# EAGLE design Laser_Terminal_new (EAGLE 9.2.2)
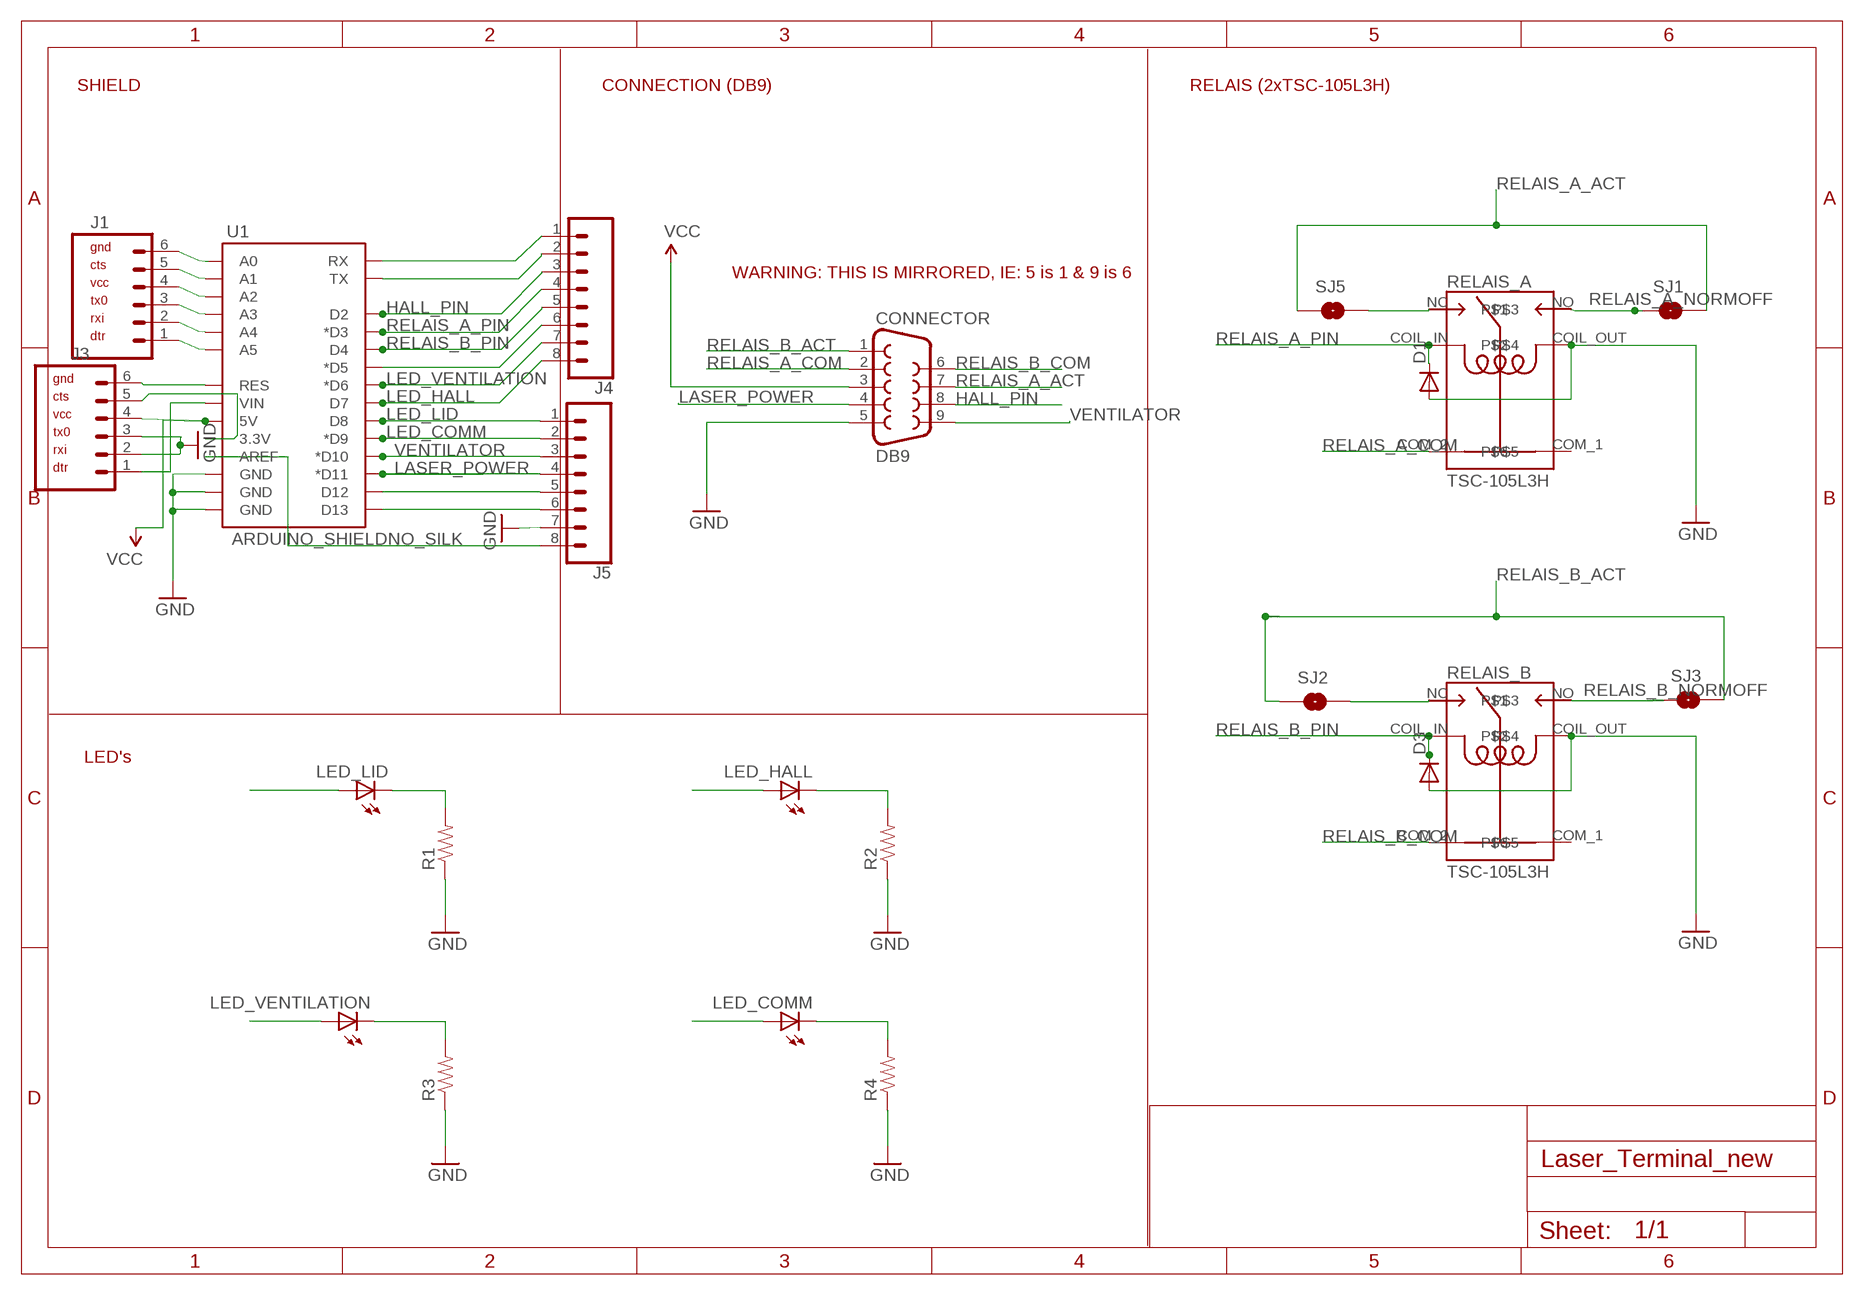
[diagram p0: schematic, sheet 1]

## Parts
CONNECTOR  DB9  DB9MALE  [DB9_MALE]
D1  DIODEPTH  [DIODE-1N4001]
D3  DIODEPTH  [DIODE-1N4001]
J1  M06NO_SILK_YES_STOP  [1X06_NO_SILK_YES_STOP]
J3  M06NO_SILK_YES_STOP  [1X06_NO_SILK_YES_STOP]
J4  CONN_08"  [1X08]
J5  CONN_08"  [1X08]
LED_COMM  LED5MM  [LED5MM]
LED_HALL  LED5MM  [LED5MM]
LED_LID  LED5MM  [LED5MM]
LED_VENTILATION  LED5MM  [LED5MM]
R1  RESISTORAXIAL-0.3  [AXIAL-0.3]
R2  RESISTORAXIAL-0.3  [AXIAL-0.3]
R3  RESISTORAXIAL-0.3  [AXIAL-0.3]
R4  RESISTORAXIAL-0.3  [AXIAL-0.3]
RELAIS_A  TSC-105L3H  TSC-112L3H  [TSC_112L3H]
RELAIS_B  TSC-105L3H  TSC-112L3H  [TSC_112L3H]
SJ1  SOLDERJUMPERNO  [SJ_2S-NO]
SJ2  SOLDERJUMPERNO  [SJ_2S-NO]
SJ3  JUMPER-SMT_2_NO_SILK  [SMT-JUMPER_2_NO_SILK]
SJ5  SOLDERJUMPERNO  [SJ_2S-NO]
U1  ARDUINO_SHIELDNO_SILK  [DUEMILANOVE_VIAS]

## Nets
GND: CONNECTOR.5 D1.A D3.A J3.2 J3.3 J5.7 R1.P$1 R2.P$1 R3.P$1 R4.P$1 RELAIS_A.COIL_OUT RELAIS_B.COIL_OUT U1.GND@0(GND) U1.GND@1(GND) U1.GND@2(GND)
HALL_PIN: CONNECTOR.8 J4.3 U1.D2
LASER_POWER: CONNECTOR.4 J5.4 U1.D11(*D11)
LED_COMM: J5.2 LED_COMM.A U1.D9(*D9)
LED_HALL: J4.8 LED_HALL.A U1.D7
LED_LID: J5.1 LED_LID.A U1.D8
LED_VENTILATION: J4.7 LED_VENTILATION.A U1.D6(*D6)
N$1: RELAIS_B.NC SJ2.2
N$3: J1.6 U1.A0
N$4: J1.5 U1.A1
N$5: J1.4 U1.A2
N$6: J1.3 U1.A3
N$7: LED_LID.K(C) R1.P$2
N$8: LED_HALL.K(C) R2.P$2
N$9: LED_VENTILATION.K(C) R3.P$2
N$10: LED_COMM.K(C) R4.P$2
N$11: J1.2 U1.A4
N$12: J1.1 U1.A5
N$13: J5.5 U1.D12
N$14: J5.6 U1.D13
N$15: RELAIS_A.NC SJ5.2
N$16: J3.1 U1.VIN
N$19: J3.5 U1.3.3V
N$20: J3.6 U1.RES
N$21: J4.1 U1.RX
N$22: J4.2 U1.TX
N$28: J4.6 U1.D5(*D5)
N$29: J5.8 U1.AREF
RELAIS_A_ACT: CONNECTOR.7 SJ1.2 SJ5.1
RELAIS_A_COM: CONNECTOR.2 RELAIS_A.COM_2
RELAIS_A_NORMOFF: RELAIS_A.NO SJ1.1
RELAIS_A_PIN: D1.C J4.4 RELAIS_A.COIL_IN U1.D3(*D3)
RELAIS_B_ACT: CONNECTOR.1 SJ2.1 SJ3.2
RELAIS_B_COM: CONNECTOR.6 RELAIS_B.COM_2
RELAIS_B_NORMOFF: RELAIS_B.NO SJ3.1
RELAIS_B_PIN: D3.C J4.5 RELAIS_B.COIL_IN U1.D4
VCC: CONNECTOR.3 J3.4 U1.5V
VENTILATOR: CONNECTOR.9 J5.3 U1.D10(*D10)
Unconnected: RELAIS_A.COM_1 RELAIS_B.COM_1

## Notes on the sheet
- SHIELD | CONNECTION (DB9) | RELAIS (2xTSC-105L3H)
- WARNING: THIS IS MIRRORED, IE: 5 is 1 & 9 is 6
- LED's

## Library data of the parts
CONNECTOR = SparkFun:DB9: DB9 Connector Standard DB9 (D-Sub 9) serial connector. Can be used for CAN bus as well as RS485 and RS232. Footprint production proven. Spark Fun Electronics SKU : PRT-00429
D1 D3 = SparkFun:DIODE: Diode These are standard reverse protection diodes and small signal diodes. SMA package can handle up to about 1A. SOD-323 can handle about 200mA. What the SOD-323 package when ordering, there are some mfgs out there that are 5-pin packages.
J1 J3 = SparkFun-Connectors:M06: Header 6 Standard 6-pin 0.1" header. Use with straight break away headers (SKU : PRT-00116), right angle break away headers (PRT-00553), swiss pins (PRT-00743), machine pins (PRT-00117), and female headers (PRT-00115). Molex polarized connector foot print use with SKU : PRT-08094 with associated crimp pins and housings. NOTES ON THE VARIANTS LOCK and LOCK_LONGPADS... This footprint was designed to help hold the alignment of a through-hole component (i.e. 6-pin header) while soldering it into place. You may notice that each hole has been shifted either up or down by 0.005 of an inch from it's more standard position (which is a perfectly straight line). This slight alteration caused the pins (the squares in the middle) to touch the edges of the holes. Because they are alternating, it causes a "brace" to hold the component in place. 0.005 has proven to be the perfect amount of "off-center" position when using our standard breakaway headers. Although looks a little odd when you look at the bare footprint, once you have a header in there, the alteration is very hard to notice. Also,if you push a header all the way into place, it is covered up entirely on the bottom side. This idea of altering the position of holes to aid alignment will be further integrated into the Sparkfun Library for other footprints. It can help hold any component with 3 or more connection pins.
J4 J5 = SparkFun-Connectors:CONN_08: Multi connection point. Often used as Generic Header-pin footprint for 0.1 inch spaced/style header connections On any of the 0.1 inch spaced packages, you can populate with these: Break Away Headers - Straight <https://www.sparkfun.com/products/116> (PRT-00116) Break Away Male Headers - Right Angle <https://www.sparkfun.com/products/553> (PRT-00553) Female Headers <https://www.sparkfun.com/products/115> (PRT-00115) Break Away Headers - Machine Pin <https://www.sparkfun.com/products/117> (PRT-00117) Break Away Female Headers - Swiss Machine Pin <https://www.sparkfun.com/products/743> (PRT-00743) Arduino Stackable Header - 8 Pin <https://www.sparkfun.com/products/9279> (PRT-09279) For SCREWTERMINALS and SPRING TERMINALS visit here: Screw Terimnals on SparkFun.com <https://www.sparkfun.com/search/results?term=Screw+Terminals> (5mm/3.5mm/2.54mm spacing) This device is also useful as a general connection point to wire up your design to another part of your project. Our various solder wires solder well into these plated through hole pads. Hook-Up Wire - Assortment (Stranded, 22 AWG) <https://www.sparkfun.com/products/11375> (PRT-11375) Hook-Up Wire - Assortment (Solid Core, 22 AWG) <https://www.sparkfun.com/products/11367> (PRT-11367) View the entire wire category on our website here <https://www.sparkfun.com/categories/141> Special notes: Molex polarized connector foot print use with SKU : PRT-08231 with associated crimp pins and housings. 1MM SMD Version SKU: PRT-10208 NOTES ON THE VARIANTS LOCK and LOCK_LONGPADS... This footprint was designed to help hold the alignment of a through-hole component (i.e. 6-pin header) while soldering it into place. You may notice that each hole has been shifted either up or down by 0.005 of an inch from it's more standard position (which is a perfectly straight line). This slight alteration caused the pins (the squares in the middle) to touch the edges of the holes. Because they are alternating, it causes a "brace" to hold the component in place. 0.005 has proven to be the perfect amount of "off-center" position when using our standard breakaway headers. Although looks a little odd when you look at the bare footprint, once you have a header in there, the alteration is very hard to notice. Also,if you push a header all the way into place, it is covered up entirely on the bottom side.; PROD_ID: CONN-08438
LED_COMM LED_HALL LED_LID LED_VENTILATION = SparkFun:LED: LEDs Standard schematic elements and footprints for 5mm, 3mm, 1206, and 0603 sized LEDs. 5mm - Spark Fun Electronics SKU : COM-00529 (and others)
R1-R4 = SparkFun:RESISTOR: Resistor Basic schematic elements and footprints for 0603, 1206, and PTH resistors.
RELAIS_A RELAIS_B = Custom:TSC-112L3H
SJ1 SJ2 SJ5 = RP400N501A:SOLDERJUMPER: Solder Jumper Standard SMD solder jumper. Used to automate production. Two varients : Normally Open and Normally Closed are the same, but have different paste layers. NC will have a large amount of paste and should jumper during reflow.
SJ3 = SparkFun-Jumpers:JUMPER-SMT_2_NO: Normally open jumper This jumper has two pads in close proximity to each other. Apply solder to close the connection. Round pads are easier to solder for beginners, but are a lot larger. SparkFun Product that uses the round pads: SparkFun EL Sequencer <https://www.sparkfun.com/products/12781>
U1 = SparkFun:ARDUINO_SHIELD

## Board
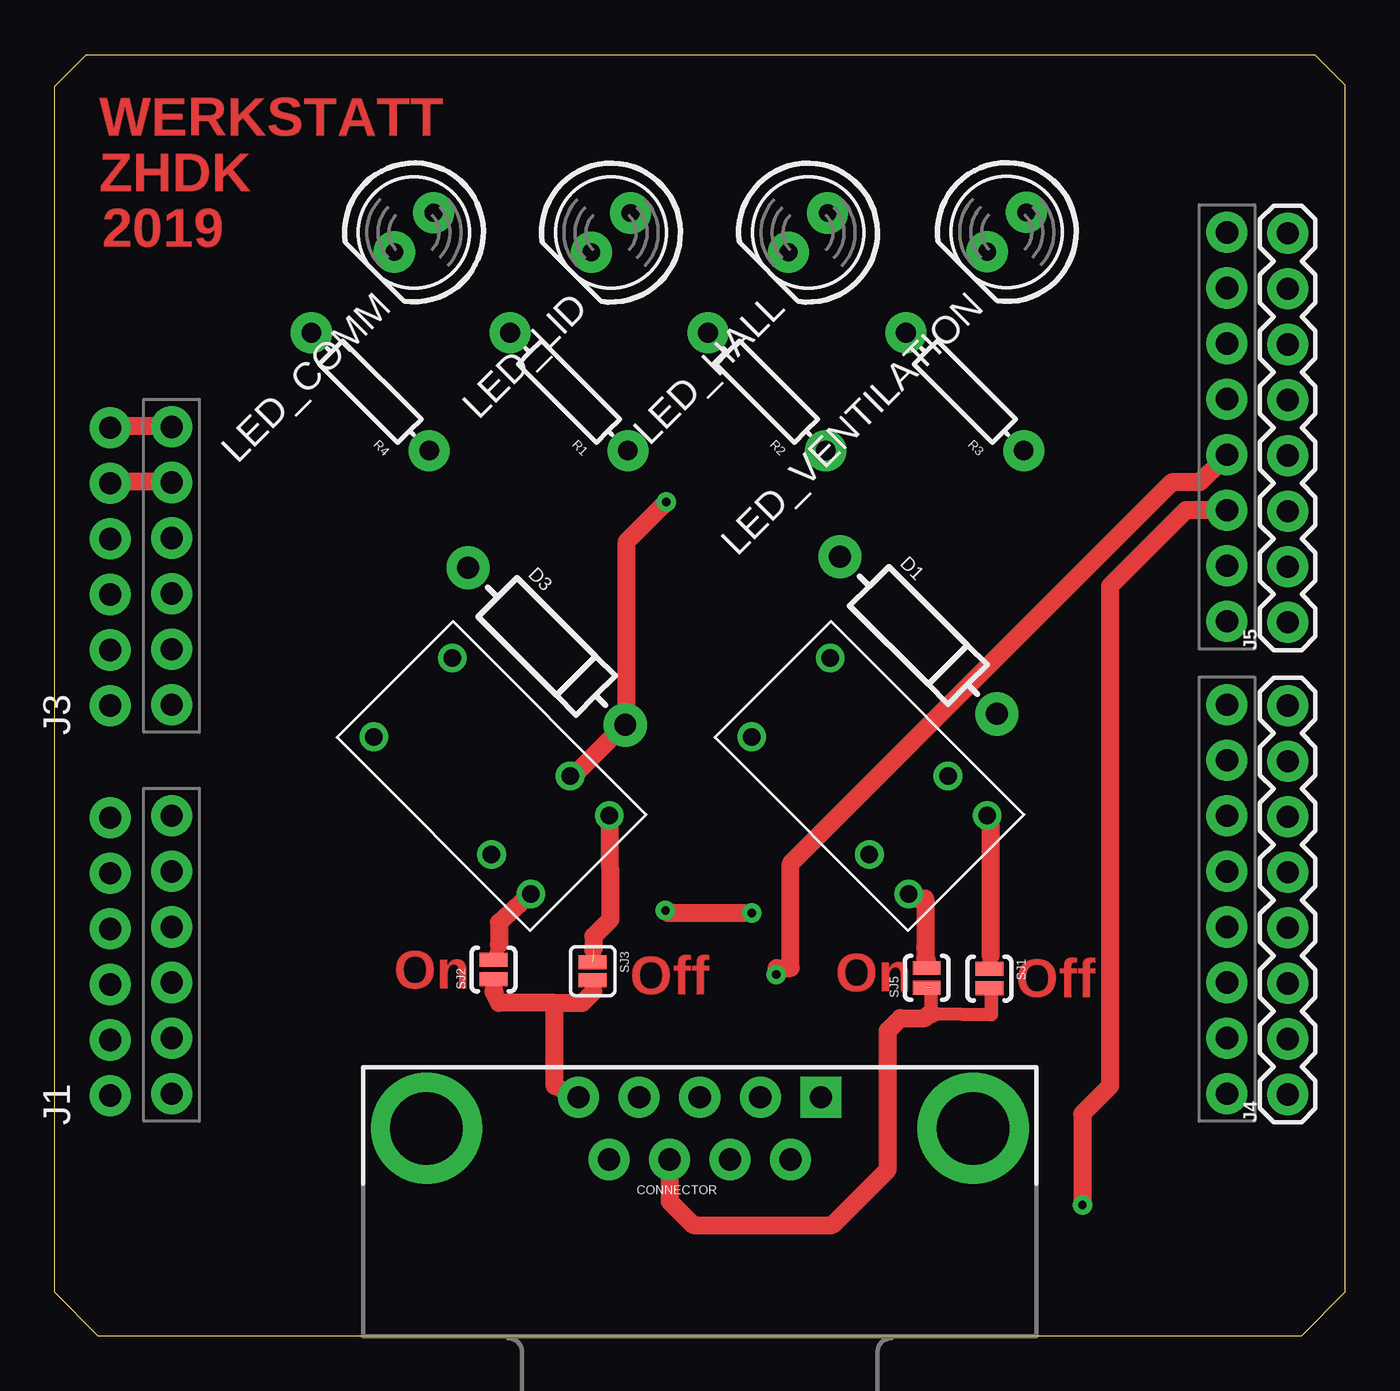
[diagram p1: board, top side]
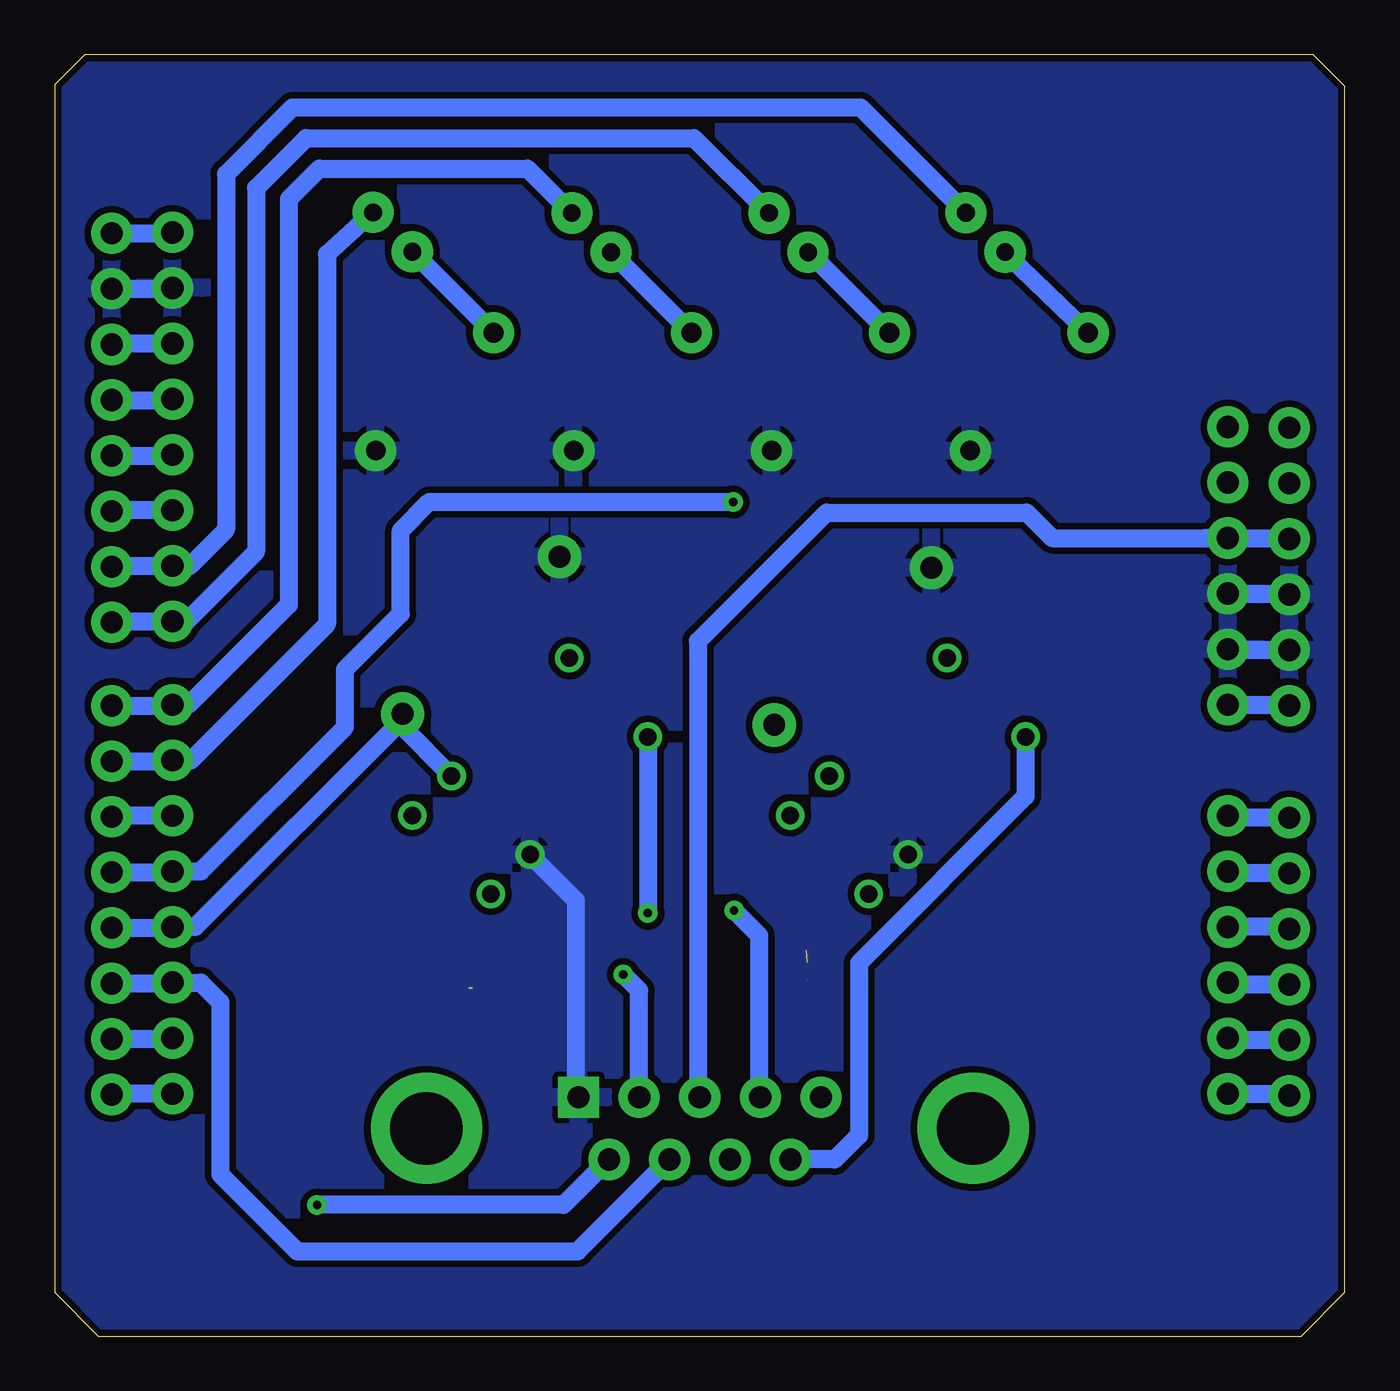
[diagram p2: board, bottom side, seen from below]

Size 59 x 58.59 mm. Coordinates in mm from the lower left corner, seen from the top.
Outline: 59,2 57,0 2,0 0,2 0,57.15 1.44,58.59 57.62,58.59 59,57.2 59,2
Copper layers (1*16): Top 0.035mm / dielectric 1.5mm / Bottom 0.035mm
Design rules "SparkFun-2-layer-STANDARD *": minimum track width 24mil, minimum drill 20mil, track to track 8mil, track to pad 8mil, pad to pad 8mil, via to via 10mil, smd to smd 8mil, copper to edge 8mil, drill to drill 8mil, minimum pad ring 10mil, minimum via ring 10mil, stop-mask expansion 4mil, vias tented up to drill 25mil, thermal gap 10mil

### Footprints (pad centres in the part's own frame; a part is rotated, then mirrored left to right if it is on the bottom)
DB9_MALE = drill 1.016 pad 1.88: 1 5.54,-1.42; 2 2.77,-1.42; 3 0,-1.42; 4 -2.77,-1.42; 6 4.15,1.42; 7 1.38,1.42; 8 -1.38,1.42; 9 -4.15,1.42 | drill 1.016 pad 1.88 square: 5 -5.54,-1.42 | drill 3.302 pad 5.08: G1 -12.5,0; G2 12.5,0
DIODE-1N4001 = drill 1 pad 1.981: A -5.08,0; C 5.08,0
1X06_NO_SILK_YES_STOP = drill 1.016 pad 1.88: 1 0,0; 2 2.54,0; 3 5.08,0; 4 7.62,0; 5 10.16,0; 6 12.7,0
1X08 = drill 1.016 pad 1.88: 1 0,0; 2 2.54,0; 3 5.08,0; 4 7.62,0; 5 10.16,0; 6 12.7,0; 7 15.24,0; 8 17.78,0
LED5MM = drill 0.813 pad 1.88: A -1.27,0; K 1.27,0
AXIAL-0.3 = drill 0.9 pad 1.88: P$1 -3.81,0; P$2 3.81,0
TSC_112L3H = drill 0.8: COIL_IN 1.21,8.79; COIL_OUT 6.29,8.79; COM_1 1.21,1.17; COM_2 6.29,1.17; NC 6.29,11.33; NO 1.21,11.33
SJ_2S-NO = smd 0.635 x 1.27: 1 -0.45,0; 2 0.45,0
SMT-JUMPER_2_NO_SILK = smd 0.635 x 1.27: 1 -0.406,0; 2 0.406,0
DUEMILANOVE_VIAS = drill 1.016 pad 1.88: 3.3V 50.8,13.97; 5V 50.8,16.51; A0 50.8,29.21; A1 50.8,31.75; A2 50.8,34.29; A3 50.8,36.83; A4 50.8,39.37; A5 50.8,41.91; AREF 2.54,2.54; D2 2.54,36.83; D3 2.54,34.29; D4 2.54,31.75; D5 2.54,29.21; D6 2.54,26.67; D7 2.54,24.13; D8 2.54,20.32; D9 2.54,17.78; D10 2.54,15.24; D11 2.54,12.7; D12 2.54,10.16; D13 2.54,7.62; GND@0 50.8,19.05; GND@1 50.8,21.59; GND@2 2.54,5.08; RES 50.8,11.43; RX 2.54,41.91; TX 2.54,39.37; VIN 50.8,24.13

### Placement (x,y rotation side)
CONNECTOR  29.5,9.5 180 top
D1  39.5,32.04 315 top
D3  22.5,31.54 315 top
J1  2.54,11 90 top
J3  2.54,28.83 90 top
J4  56.39,11.05 90 top
J5  56.39,32.64 90 top
LED_COMM  16.43,50.46 225 top
LED_HALL  34.45,50.45 225 top
LED_LID  25.44,50.45 225 top
LED_VENTILATION  43.54,50.48 225 top
R1  23.52,43.18 135 top
R2  32.57,43.18 135 top
R3  41.62,43.18 135 top
R4  14.43,43.18 135 top
RELAIS_A  35.49,32.68 225 top
RELAIS_B  18.21,32.68 225 top
SJ1  42.74,16.35 270 top
SJ2  20.07,16.76 90 top
SJ3  24.6,16.69 270 top
SJ5  39.88,16.38 90 top
U1  56.15,53 180 top

### Tracks (layer width: path | path; a pad name or v marks a point on that pad's centre or on a via)
GND
  Bottom 0.813: RELAIS_A.COIL_OUT 37.26,21.94 | CONNECTOR.5 35.17,11.05 35.17,19.93 RELAIS_A.COIL_OUT | J3.2 5.31,31.37 U1.GND@1 | J3.3 5.31,33.91 U1.GND@0 | J5.7 53.65,47.88 U1.GND@2 | RELAIS_A.COIL_OUT | 37.47,22.23 RELAIS_A.COIL_OUT
  pour Bottom (isolate 0.305, rank 3): 61.54,0 -3.81,0 -3.81,64.81 61.54,64.81
HALL_PIN
  Bottom 0.813: CONNECTOR.8 35.08,3.88 47.9,3.88 51.43,7.4 51.43,15.28 52.32,16.17 U1.D2 53.65,16.13 J4.3
LASER_POWER  (via drill 0.38)
  Top 0.813: U1.D11 53.34,40.01 52.39,39.05 51.12,39.05 33.66,21.59 33.66,16.83 33.02,16.83 v33,16.54
  Bottom 0.813: CONNECTOR.4 32.27,15.81 v33,16.54 | J5.4 53.65,40.26 U1.D11
LED_COMM
  Bottom 0.813: 17.43,51.46 22.14,56.17 48.12,56.17 51.17,53.12 51.17,36.87 52.81,35.22 U1.D9 56.35,35.22 J5.2 | 17.43,51.46 LED_COMM.A | LED_COMM.A | LED_COMM.A 17.46,51.44 17.43,51.46
LED_HALL
  Bottom 0.813: 35.5,51.5 37.38,53.38 46.9,53.38 48.3,51.98 48.3,33.44 52.87,28.87 U1.D7 53.65,28.83 J4.8 | 35.5,51.5 LED_HALL.A | LED_HALL.A | LED_HALL.A 35.56,51.44 35.5,51.5
LED_LID
  Bottom 0.813: 26.39,51.4 29.77,54.77 47.51,54.77 49.8,52.49 49.8,35.85 52.97,32.68 U1.D8 56.35,32.68 J5.1 | 26.39,51.4 LED_LID.A | LED_LID.A | LED_LID.A 26.35,51.44 26.39,51.4
LED_VENTILATION
  Bottom 0.813: LED_VENTILATION.A 46.55,49.47 46.55,32.55 52.77,26.33 U1.D6 53.65,26.29 J4.7 | LED_VENTILATION.A | 44.45,51.44 LED_VENTILATION.A
N$1
  Top 0.61: 20.32,17.91 SJ2.2
  Top 0.813: 21.59,20 RELAIS_B.NC 20.32,18.92 20.32,17.91
N$2
  Bottom 0.813: 23.71,25.61 23.57,25.61
N$3
  Bottom 0.813: J1.6 5.26,23.7 U1.A0
N$4
  Bottom 0.813: J1.5 5.26,21.16 U1.A1
N$5
  Bottom 0.813: J1.4 3.09,18.71 U1.A2
N$6
  Bottom 0.813: U1.A3 5.26,16.08 J1.3
N$7
  Bottom 0.813: LED_LID.K | LED_LID.K 24.38,49.43 | 24.38,49.43 20.97,46.02 | 20.97,46.02 R1.P$2 | R1.P$2 | 20.97,46.02 20.95,46.04 R1.P$2 | 24.38,49.43 24.45,49.53 LED_LID.K
N$8
  Bottom 0.813: LED_HALL.K | LED_HALL.K 33.3,49.3 | 33.3,49.3 30.1,46.1 | 30.1,46.1 R2.P$2 | R2.P$2 | 30.1,46.1 30.16,46.04 R2.P$2 | 33.3,49.3 33.34,49.53 LED_HALL.K
N$9
  Bottom 0.813: LED_VENTILATION.K | LED_VENTILATION.K 42.38,49.32 | 42.38,49.32 39.07,46.02 | 39.07,46.02 R3.P$2 | R3.P$2 | 39.07,46.02 39.05,46.04 R3.P$2 | 42.38,49.32 42.55,49.53 LED_VENTILATION.K
N$10
  Bottom 0.813: LED_COMM.K | LED_COMM.K 15.41,49.42 | 15.41,49.42 11.82,45.96 | 11.82,45.96 R4.P$2 | R4.P$2 | 11.82,45.96 11.75,46.04 R4.P$2 | 15.41,49.42 15.56,49.53 LED_COMM.K
N$11
  Bottom 0.813: J1.2 5.26,13.54 U1.A4
N$12
  Bottom 0.813: U1.A5 3.09,11.09 J1.1
N$13
  Bottom 0.813: J5.5 53.65,42.8 U1.D12
N$14
  Bottom 0.813: U1.D13 56.35,45.38 J5.6
N$15
  Top 0.61: 39.81,17.78 SJ5.2
  Top 0.813: 39.88,17.21 39.81,17.28 39.81,17.78 39.81,20 39.37,20 RELAIS_A.NC
N$16
  Bottom 0.813: U1.VIN 2.96,28.87 J3.1
N$19
  Top 0.813: J3.5 3.17,39.05 5.08,39.05 U1.3.3V
N$20
  Top 0.813: J3.6 3.17,41.59 5.08,41.59 U1.RES
N$21
  Bottom 0.813: U1.RX 56.35,11.09 J4.1
N$22
  Bottom 0.813: J4.2 53.65,13.59 U1.TX
N$28
  Bottom 0.813: U1.D5 56.35,23.79 J4.6
N$29
  Bottom 0.813: J5.8 53.65,50.42 U1.AREF
RELAIS_A_ACT  (1 unrouted)
  Top 0.61: SJ1.2 42.84,15.8 42.84,14.69 40.13,14.73 40.06,14.8 40.06,15.93
  Top 0.813: CONNECTOR.7 28.12,6.17 29.21,5.08 35.56,5.08 38.1,7.62 38.1,13.97 38.68,14.55 39.81,14.55 39.99,14.73 40.13,14.73
RELAIS_A_COM  (via drill 0.38)
  Top 0.813: v31.87,19.34 28.06,19.34 v27.93,19.47
  Bottom 0.813: RELAIS_A.COM_2 v31.87,19.34 | v27.93,19.47 26.79,18.33 26.79,10.98 CONNECTOR.2 | RELAIS_A.COM_2 | 32.07,27.3 RELAIS_A.COM_2 | RELAIS_A.COM_2
RELAIS_A_NORMOFF
  Top 0.61: 42.8,17.4 42.74,17.3 SJ1.1
  Top 0.813: 42.8,17.4 42.8,23.75 42.86,23.81 RELAIS_A.NO
RELAIS_A_PIN
  Bottom 0.813: D1.C 43.09,27.85 RELAIS_A.COIL_IN 43.26,28.02 52.57,18.71 U1.D3 53.65,18.67 J4.4
RELAIS_B_ACT  (1 unrouted)
  Top 0.61: 20.32,15.24 SJ2.1 | 24.64,15.75 24.64,16.23 24.6,16.27
  Top 0.813: 23.81,11.11 CONNECTOR.1 22.86,11.43 22.86,15.24 | 22.86,15.24 24.13,15.24 24.64,15.75 | 22.86,15.24 20.32,15.24 20.07,15.75
  Bottom 0.813: 24.07,10.96 CONNECTOR.1
RELAIS_B_COM
  Bottom 0.813: CONNECTOR.6 23.32,8.08 22.22,9.18 22.22,17.06 14.6,24.68 14.6,27.3 | 14.6,27.3 RELAIS_B.COM_2 | RELAIS_B.COM_2 | RELAIS_B.COM_2 14.61,27.3 14.6,27.3
RELAIS_B_NORMOFF  (1 unrouted)
  Top 0.813: RELAIS_B.NO 25.4,19.05 24.64,18.29 24.64,17.65
RELAIS_B_PIN  (via drill 0.38)
  Top 0.813: RELAIS_B.COIL_IN 23.81,25.72 26.04,27.94 D3.C 26.16,28.02 26.16,36.33 v27.97,38.14
  Bottom 0.813: v27.97,38.14 41.87,38.14 43.18,36.83 43.18,33.02 45.72,30.48 45.72,27.84 52.31,21.25 U1.D4 53.65,21.21 J4.5
VCC
  Bottom 0.813: CONNECTOR.3 29.58,11.13 29.58,31.77 23.7,37.66 14.54,37.66 13.38,36.49 U1.5V | U1.5V 2.96,36.49 J3.4 | U1.5V 6.4,36.49
VENTILATOR  (via drill 0.38)
  Top 0.813: U1.D10 51.73,37.76 48.26,34.29 48.26,11.43 46.99,10.16 v46.99,6.01 v47,6
  Bottom 0.813: CONNECTOR.9 35.73,6 v47,6 | U1.D10 56.35,37.76 J5.3

### Text on the board
Top: WERKSTATT | ZHDK | 2019 | On | Off | On | Off
tStop: WERKSTATT | ZHDK | 2019 | On | Off | On | Off